# Altium schematic sheet ADCS.SchDoc
size A
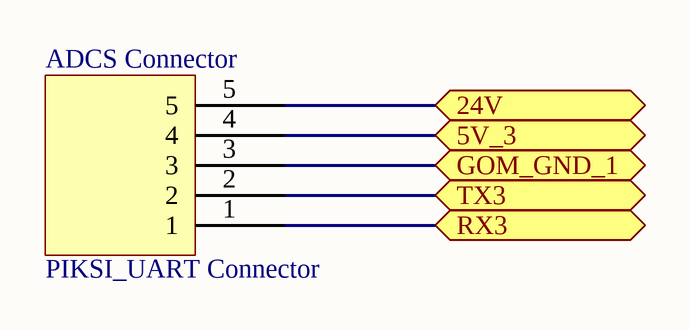
[diagram p0: ADCS.SchDoc]

## Parts
ADCS_Connector  PIKSI_UART Connector  [Molex Picoblade 5 Pin]

## Ports
5V_3 (bidir), 24V (bidir), GOM_GND_1 (bidir), RX3 (bidir), TX3 (bidir)

## Nets
5V_3: ADCS_Connector.4 ; port 5V_3
24V: ADCS_Connector.5 ; port 24V
GOM_GND_1: ADCS_Connector.3 ; port GOM_GND_1
RX3: ADCS_Connector.1 ; port RX3
TX3: ADCS_Connector.2 ; port TX3

## Library data of the parts
ADCS_Connector = PIKSI_UART Connector: Molex Picoblade 53261-0571